# Altium project _1PCB_MAIN (1).PrjPcb
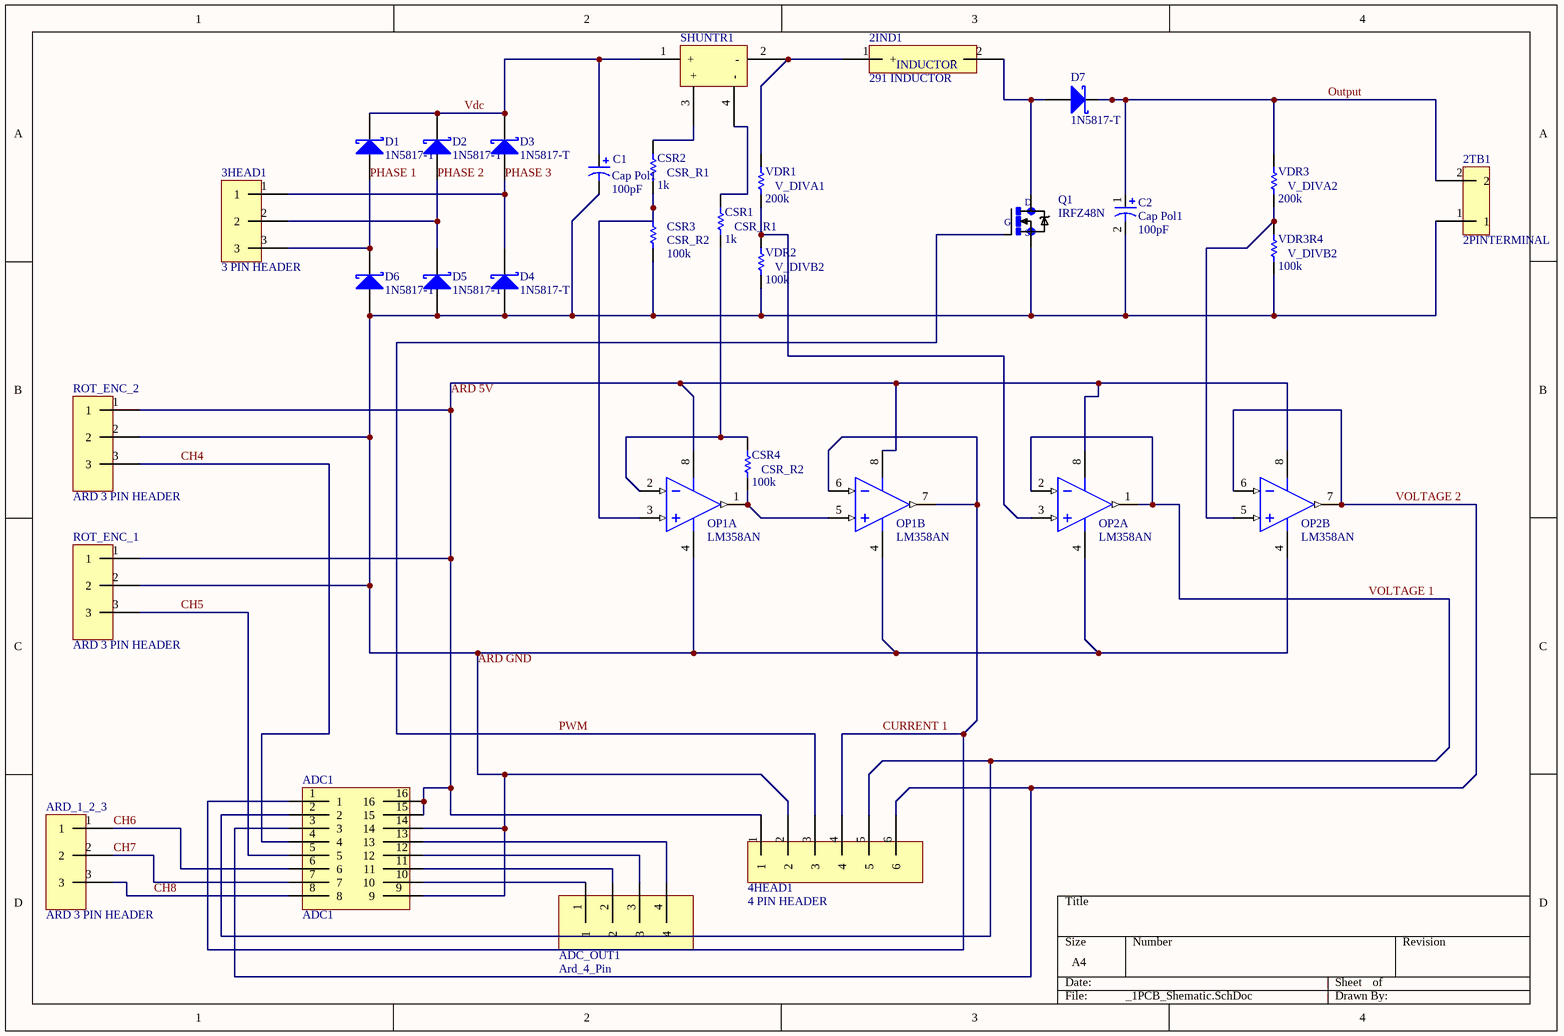
[diagram p0: _1PCB_Shematic.SchDoc]
1 sheet, 30 parts. Net scope: global (net labels, ports and power ports of the same name join across sheets).
Board file: Final_PCB.PcbDoc

## Sheet _1PCB_Shematic.SchDoc
size A4

### Parts
2IND1  291 INDUCTOR  [3 CM INDUCTOR]
2TB1  2PINTERMINAL  [2 PIN TERMINAL BLOCK]
3HEAD1  3 PIN HEADER  [3 PIN HEADER]
4HEAD1  4 PIN HEADER  [4 PIN HEADER]
ADC1  ADC1  [PDIP16_300MC]
ADC_OUT1  Ard_4_Pin  [ARD_4_PIN]
ARD_1_2_3  ARD 3 PIN HEADER  [ARD 3 PIN HEADER]
C1  Cap Pol1  value 100pF  [PCBComponent_1]
C2  Cap Pol1  value 100pF  [PCBComponent_1]
CSR1  CSR_R1  value 1k  [AXIAL-0.3]
CSR2  CSR_R1  value 1k  [AXIAL-0.3]
CSR3  CSR_R2  value 100k  [AXIAL-0.3]
CSR4  CSR_R2  value 100k  [AXIAL-0.3]
D1  1N5817-T  [DIOD-DO-41-P-2]
D2  1N5817-T  [DIOD-DO-41-P-2]
D3  1N5817-T  [DIOD-DO-41-P-2]
D4  1N5817-T  [DIOD-DO-41-P-2]
D5  1N5817-T  [DIOD-DO-41-P-2]
D6  1N5817-T  [DIOD-DO-41-P-2]
D7  1N5817-T  [DIOD-DO-41-P-2]
OP1  LM358AN  [N08E]  (parts A,B of 2)
OP2  LM358AN  [N08E]  (parts A,B of 2)
Q1  IRFZ48N  [TO220BV_IRFZ48N(Primary)]
ROT_ENC_1  ARD 3 PIN HEADER  [ARD 3 PIN HEADER]
ROT_ENC_2  ARD 3 PIN HEADER  [ARD 3 PIN HEADER]
SHUNTR1  (no value)  [SHUNT15.24]
VDR1  V_DIVA1  value 200k  [AXIAL-0.3]
VDR2  V_DIVB2  value 100k  [AXIAL-0.3]
VDR3  V_DIVA2  value 200k  [AXIAL-0.3]
VDR3R4  V_DIVB2  value 100k  [AXIAL-0.3]

### Nets
ARD 5V: 4HEAD1.1 ADC1.15 ADC1.16 OP1.8(V+) OP2.8(V+) ROT_ENC_1.1 ROT_ENC_2.1
ARD GND: 2TB1.1 4HEAD1.2 ADC1.9 ADC1.14 C1.2 C2.2 CSR3.2 D4.1(A) D5.1(A) D6.1(A) OP1.4(GND) OP2.4(GND) Q1.S ROT_ENC_1.2 ROT_ENC_2.2 VDR2.2 VDR3R4.2
CH4: ADC1.4 ROT_ENC_2.3
CH5: ADC1.5 ROT_ENC_1.3
CH6: ADC1.6 ARD_1_2_3.1
CH7: ADC1.7 ARD_1_2_3.2
CH8: ADC1.8 ARD_1_2_3.3
CURRENT 1: 4HEAD1.4 ADC1.1 OP1.6(INB-) OP1.7(OUTB)
Output: 2TB1.2 C2.1 D7.2(K) VDR3.1
PHASE 1: 3HEAD1.3 D1.1(A) D6.2(K)
PHASE 2: 3HEAD1.2 D2.1(A) D5.2(K)
PHASE 3: 3HEAD1.1 D3.1(A) D4.2(K)
PWM: 4HEAD1.3 Q1.G
Vdc: C1.1 D1.2(K) D2.2(K) D3.2(K) SHUNTR1.1(+)
VOLTAGE 1: 4HEAD1.5 ADC1.2 OP2.1(OUTA) OP2.2(INA-)
VOLTAGE 2: 4HEAD1.6 ADC1.3 OP2.6(INB-) OP2.7(OUTB)
Net2IND1_1: 2IND1.1(+) SHUNTR1.2(-) VDR1.1
Net2IND1_2: 2IND1.2(-) D7.1(A) Q1.D
NetADC1_10: ADC1.10 ADC_OUT1.1
NetADC1_11: ADC1.11 ADC_OUT1.2
NetADC1_12: ADC1.12 ADC_OUT1.3
NetADC1_13: ADC1.13 ADC_OUT1.4
NetCSR1_1: CSR1.1 CSR4.1 OP1.2(INA-)
NetCSR1_2: CSR1.2 SHUNTR1.4(-)
NetCSR2_1: CSR2.1 CSR3.1 OP1.3(INA+)
NetCSR2_2: CSR2.2 SHUNTR1.3(+)
NetCSR4_2: CSR4.2 OP1.1(OUTA) OP1.5(INB+)
NetOP2_3: OP2.3(INA+) VDR1.2 VDR2.1
NetOP2_5: OP2.5(INB+) VDR3.2 VDR3R4.1

### Notes on the sheet
- (in symbol 2IND?) INDUCTOR

### Library data of the parts
2IND1 = 2IND?
2TB1 = 2TB?
3HEAD1 = 3HEAD?
4HEAD1 = 4HEAD?
ADC1 = MCP3008
ADC_OUT1 = APIN?
ARD_1_2_3 ROT_ENC_1 ROT_ENC_2 = ARD_3_PIN?
C1 C2 = Cap Pol1: Polarized Capacitor (Radial); Published: 8-Jun-2000; LatestRevisionDate: 17-Jul-2002; LatestRevisionNote: Re-released for DXP Platform.; PackageReference: RB7.6-15; Publisher: Altium Limited; PackageDescription: Polarized Capacitor (Radial); 2 Leads
CSR1-CSR4 VDR1-VDR3 VDR3R4 = Res1: Resistor; Published: 8-Jun-2000; LatestRevisionDate: 17-Jul-2002; LatestRevisionNote: Re-released for DXP Platform.; PackageReference: AXIAL-0.3; Publisher: Altium Limited; PackageDescription: Axial Device, Thru-Hole; 2 Leads; 0.3 in Pin Spacing
D1-D7 = CMP-2000-05521-1: Schottky Barrier Rectifier, 1 A, 20 V, -65 to 125 degC, 2-Pin DO-41, RoHS, Tape and Reel; Manufacturer: DiodesIncorporated; Vrrm - Repetitive Reverse Voltage: 20V; If - Forward Current: 1A; Configuration: Single; Unit Weight: 0.010582oz; Type: SchottkyDiode; Ifsm - Forward Surge Current: 25A; Vf - Forward Voltage: 0.75Vat3A; Ir - Reverse Current: 1000uA; Technology: Si; Length: 5.21mm; Product: SchottkyRectifiers; Package Reference: DO-41-P-2; Package / Case: DO-41; Datasheet URL: http://www.diodes.com/_files/datasheets/ds23001.pdf; Operating Temperature Range: -65Cto+125C; Mounting Style: ThroughHole; Manufacturer URL: http://www.diodes.com/; Series: 1N58; Minimum Operating Temperature: -65C; Height: 2.72mm; Brand: DiodesIncorporated; Maximum Operating Temperature: +125C; Datasheet Version: Rev. 8-2, 05/2009; Factory Pack Quantity: 5000; Width: 2.72mm; RoHS: True; Product Category: SchottkyDiodes&Rectifiers; Package Description: 2-Pin Through Hole Device, Body 4.635 x 2.36 mm, Pin Spacing 7.85 mm; Packaging: Reel; Termination Style: ThroughHole; Mounting Technology: ThroughHole
OP1 OP2 = CMP-0055-00164-2: Low Power Dual Operational Amplifier, 8-pin MDIP; Manufacturer: National Semiconductor; CompType: Amplifiers; PackageTopMarking: NSUZXYTTE#*LM*358AN; PowerWise: N; ComponentLink2Description: LM358 Web Page; Code_JEDEC: MS-001-BA; ComponentLink3Description: N08E Package Page; PinCount: 8; PackageReference: N08E; ComponentLink3URL: http://www.national.com/packaging/folders/n08e.html; PackageVersion: revG, May-2006; RevisionNote: Component URLs added; DatasheetVersion: Oct-2005; ComponentLink1URL: http://www.national.com/ds/LM/LM358.pdf; PackageDescription: MDIP, .365 x .250 x .130in, 8 Lead, .100in Pitch; ComponentLink2URL: http://www.national.com/pf/LM/LM358.html; ComponentLink1Description: LM358 Datasheet; RoHS: N
Q1 = IRFZ48N: 55V Single N-Channel HEXFET Power MOSFET in a TO-220AB package; MF: International Rectifier; Price: None; MP: IRFZ48N; SnapEDA_Link: https://www.snapeda.com/parts/IRFZ48N/International%20Rectifier/view-part/?ref=snap; Package: None; Availability: Unavailable; Value: *
SHUNTR1 = SHUNTR?